# Altium project Quadrotor.PrjPcb
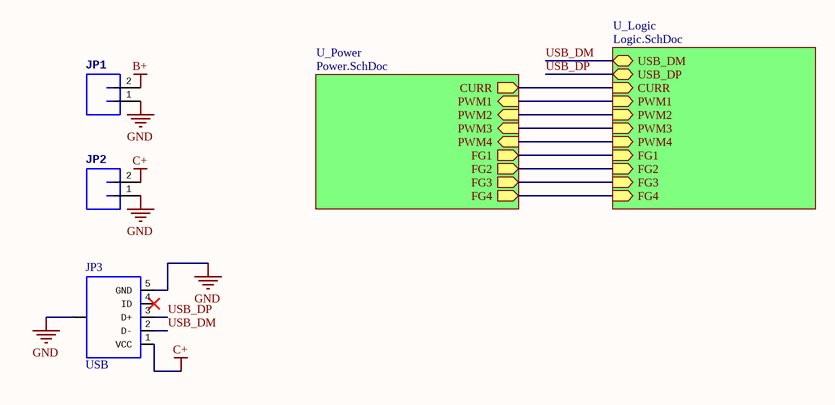
[diagram p0: Quadrotor.SchDoc]
3 sheets, 82 parts. Net scope: hierarchical (ports join the sheet entries above them; power ports are global).
Board file: Quadrotor.PcbDoc
Sheets:
  Quadrotor.SchDoc
    U_Logic = Logic.SchDoc
    U_Power = Power.SchDoc

## Sheet Quadrotor.SchDoc
size A

### Parts
JP1  (no value)  [JST-2-PTH-VERT]
JP2  (no value)  [JST-2-PTH-VERT]
JP3  USB  [USB-MICROB]

### Sub-sheets
U_Logic = Logic.SchDoc: USB_DM (bidir), USB_DP (bidir), CURR (in), PWM1 (in), PWM2 (in), PWM3 (in), PWM4 (in), FG1 (in), FG2 (in), FG3 (in), FG4 (in)
U_Power = Power.SchDoc: PWM1 (in), PWM2 (in), PWM3 (in), PWM4 (in), FG1 (out), FG2 (out), FG3 (out), FG4 (out), CURR (out)

### Nets
B+: JP1.2
C+: JP2.2 JP3.1(VCC)
GND: JP1.1 JP2.1 JP3.5(GND) JP3.6(SHIELD)
USB_DM: JP3.2(D-) ; sheet U_Logic/USB_DM
USB_DP: JP3.3(D+) ; sheet U_Logic/USB_DP
NetR3_1: sheet U_Logic/FG4, sheet U_Power/FG4
NetR4_1: sheet U_Logic/FG3, sheet U_Power/FG3
NetR6_2: sheet U_Logic/FG1, sheet U_Power/FG1
NetR7_2: sheet U_Logic/FG2, sheet U_Power/FG2
NetU1_14: sheet U_Logic/PWM1, sheet U_Power/PWM1
NetU1_15: sheet U_Logic/PWM2, sheet U_Power/PWM2
NetU1_16: sheet U_Logic/PWM3, sheet U_Power/PWM3
NetU1_17: sheet U_Logic/PWM4, sheet U_Power/PWM4
NetU1_26: sheet U_Logic/CURR, sheet U_Power/CURR

Not connected (* = marked no-connect by the designer): JP3 4(ID)*

### Library data of the parts
JP1 JP2 = JST_2_RIGHT
JP3 = USB_MICROB_PLUG-SMT: pin to pad: 1>VBUS 2>D- 3>D+ 4>ID 5>GND 6>MT1+P$1+P$2+MT2; PROD_ID: CONN-09900

## Sheet Logic.SchDoc
size A
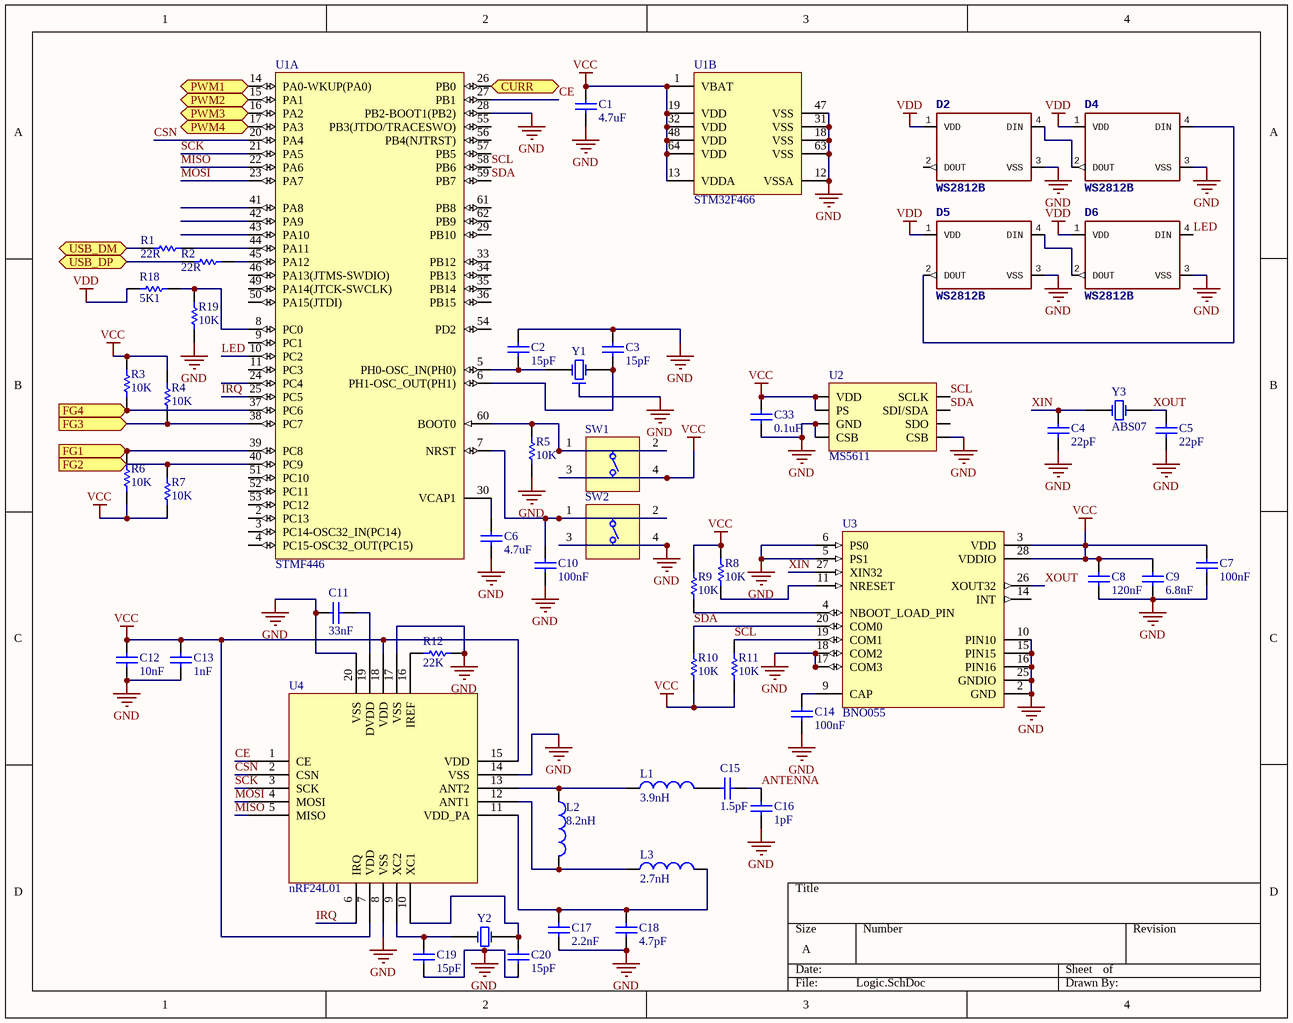
[diagram p1: Logic.SchDoc]

### Parts
C1  4.7uF  [CAPC0402(1005)60_L]
C2  15pF  [CAPC0402(1005)60_M]
C3  15pF  [CAPC0402(1005)60_M]
C4  22pF  [CAPC0402(1005)60_L]
C5  22pF  [CAPC0402(1005)60_L]
C6  4.7uF  [CAPC0402(1005)60_L]
C7  100nF  [CAPC0402(1005)60_M]
C8  120nF  [CAPC0402(1005)60_M]
C9  6.8nF  [CAPC0402(1005)60_L]
C10  100nF  [CAPC0402(1005)60_M]
C11  33nF  [CAPC0402(1005)60_M]
C12  10nF  [CAPC0402(1005)60_M]
C13  1nF  [CAPC0402(1005)60_M]
C14  100nF  [CAPC0402(1005)60_M]
C15  1.5pF  [CAPC0402(1005)60_L]
C16  1pF  [CAPC0402(1005)60_M]
C17  2.2nF  [CAPC0402(1005)60_N]
C18  4.7pF  [CAPC0402(1005)60_M]
C19  15pF  [CAPC0402(1005)60_N]
C20  15pF  [CAPC0402(1005)60_N]
C33  0.1uF  [CAPC0402(1005)60_M]
D2  WS2812B  [WS2812B]
D4  WS2812B  [WS2812B]
D5  WS2812B  [WS2812B]
D6  WS2812B  [WS2812B]
L1  3.9nH  [INDC0402(1005)_N]
L2  8.2nH  [INDC0402(1005)_N]
L3  2.7nH  [INDC0402(1005)_N]
R1  22R  [RESC0402(1005)_M]
R2  22R  [RESC0402(1005)_M]
R3  10K  [RESC0402(1005)_N]
R4  10K  [RESC0402(1005)_N]
R5  10K  [RESC0402(1005)_N]
R6  10K  [RESC0402(1005)_N]
R7  10K  [RESC0402(1005)_N]
R8  10K  [RESC0402(1005)_N]
R9  10K  [RESC0402(1005)_N]
R10  10K  [RESC0402(1005)_N]
R11  10K  [RESC0402(1005)_N]
R12  22K  [RESC0402(1005)_L]
R18  5K1  [RESC0402(1005)_L]
R19  10K  [RESC0402(1005)_N]
SW1  (no value)  [SWITCH]
SW2  (no value)  [SWITCH]
U1  STMF446  [STM-LQFP64_N]  (parts A,B of 2)
U2  MS5611  [MS5611]
U3  BNO055  [LGA28R50P4X10_380X520X100]
U4  (no value)  [QFN20]
Y1  (no value)  [ABRA-ABM3B-4_V]
Y2  (no value)  [ABRA-ABM3B-4_V]
Y3  ABS07  [ABS07]

### Ports
CURR (in), FG1 (in), FG2 (in), FG3 (in), FG4 (in), PWM1 (in), PWM2 (in), PWM3 (in), PWM4 (in), USB_DM (bidir), USB_DP (bidir)

### Nets
GND: C1.1 C2.2 C3.2 C4.1 C5.1 C6.1 C7.1 C8.1 C9.1 C10.1 C11.1 C12.1 C13.1 C14.1 C16.1 C17.1 C18.1 C19.1 C20.1 C33.1 D2.3(VSS) D4.3(VSS) D5.3(VSS) D6.3(VSS) R5.1 R12.1 R19.1 SW2.3(T3) SW2.4(T3) U1.12(VSSA) U1.18(VSS) U1.28(PB2-BOOT1(PB2)) U1.31(VSS) U1.47(VSS) U1.63(VSS) U2.3(GND) U2.4(CSB) U2.5(CSB) U3.2(GND) U3.5(PS1) U3.6(PS0) U3.10(PIN10) U3.15(PIN15) U3.16(PIN16) U3.17(COM3) U3.18(COM2) U3.25(GNDIO) U4.8(VSS) U4.14(VSS) U4.17(VSS) U4.20(VSS) Y1.2 Y2.2
VCC: C1.2 C7.2 C8.2 C9.2 C12.2 C13.2 C33.2 R3.2 R4.2 R6.1 R7.1 R8.2 R9.2 R10.1 R11.1 SW1.3(T3) SW1.4(T3) U1.1(VBAT) U1.13(VDDA) U1.19(VDD) U1.32(VDD) U1.48(VDD) U1.64(VDD) U2.1(VDD) U2.2(PS) U3.3(VDD) U3.28(VDDIO) U4.7(VDD) U4.15(VDD) U4.18(VDD)
VDD: D2.1(VDD) D4.1(VDD) D5.1(VDD) D6.1(VDD) R18.2
ANTENNA: C15.2 C16.2
CE: U1.27(PB1) U4.1(CE)
CSN: U1.20(PA4) U4.2(CSN)
IRQ: U1.25(PC5) U4.6(IRQ)
LED: D6.4(DIN) U1.10(PC2)
MISO: U1.22(PA6) U4.5(MISO)
MOSI: U1.23(PA7) U4.4(MOSI)
SCK: U1.21(PA5) U4.3(SCK)
SCL: R11.2 U1.58(PB6) U2.8(SCLK) U3.19(COM1)
SDA: R10.2 U1.59(PB7) U2.7(SDI/SDA) U3.20(COM0)
USB_DM: R1.1 ; port USB_DM
USB_DP: R2.1 ; port USB_DP
XIN: C4.2 U3.27(XIN32) Y3.1(X1)
XOUT: C5.2 U3.26(XOUT32) Y3.2(X2)
NetC2_1: C2.1 U1.5(PH0-OSC_IN(PH0)) Y1.1(X1)
NetC3_1: C3.1 U1.6(PH1-OSC_OUT(PH1)) Y1.3(X2)
NetC6_2: C6.2 U1.30(VCAP1)
NetC10_2: C10.2 SW2.1(T1) SW2.2(T2) U1.7(NRST)
NetC11_2: C11.2 U4.19(DVDD)
NetC14_2: C14.2 U3.9(CAP)
NetC15_1: C15.1 L1.2
NetC17_2: C17.2 C18.2 L3.2 U4.11(VDD_PA)
NetC19_2: C19.2 U4.9(XC2) Y2.1(X1)
NetC20_2: C20.2 U4.10(XC1) Y2.3(X2)
NetD2_4: D2.4(DIN) D4.2(DOUT)
NetD4_4: D4.4(DIN) D5.2(DOUT)
NetD5_4: D5.4(DIN) D6.2(DOUT)
NetL1_1: L1.1 L2.1 U4.13(ANT2)
NetL2_2: L2.2 L3.1 U4.12(ANT1)
NetR1_2: R1.2 U1.44(PA11)
NetR2_2: R2.2 U1.45(PA12)
NetR3_1: R3.1 U1.37(PC6) ; port FG4
NetR4_1: R4.1 U1.38(PC7) ; port FG3
NetR5_2: R5.2 SW1.1(T1) SW1.2(T2) U1.60(BOOT0)
NetR6_2: R6.2 U1.39(PC8) ; port FG1
NetR7_2: R7.2 U1.40(PC9) ; port FG2
NetR8_1: R8.1 U3.11(NRESET)
NetR9_1: R9.1 U3.4(NBOOT_LOAD_PIN)
NetR12_2: R12.2 U4.16(IREF)
NetR18_1: R18.1 R19.2 U1.8(PC0)
NetU1_14: U1.14(PA0-WKUP(PA0)) ; port PWM1
NetU1_15: U1.15(PA1) ; port PWM2
NetU1_16: U1.16(PA2) ; port PWM3
NetU1_17: U1.17(PA3) ; port PWM4
NetU1_26: U1.26(PB0) ; port CURR

Not connected (* = marked no-connect by the designer): D2 2(DOUT); U1 2(PC13) 3(PC14-OSC32_IN(PC14)) 4(PC15-OSC32_OUT(PC15)) 9(PC1) 11(PC3) 24(PC4) 29(PB10) 33(PB12) 34(PB13) 35(PB14) 36(PB15) 41(PA8) 42(PA9) 43(PA10) 46(PA13(JTMS-SWDIO)) 49(PA14(JTCK-SWCLK)) 50(PA15(JTDI)) 51(PC10) 52(PC11) 53(PC12) 54(PD2) 55(PB3(JTDO/TRACESWO)) 56(PB4(NJTRST)) 57(PB5) 61(PB8) 62(PB9); U2 6(SDO); U3 14(INT)

### Notes on the sheet
- (in symbol NRF24L01+) nRF24L01

### Library data of the parts
C1 C6 = CMP-1034-02136-1: CAP 4.7uF 6.3V ±10% 0402 (1005 Metric) Thickness 0.6mm SMD; Case-EIA: 0402; Tolerance: Â±10%; Case-Metric: 1005; Technology: SMT; Value: 4.7uF; Max Thickness: 0.6 mm; Rated Voltage: 6.3 V
C2 C3 = CMP-1034-00804-1: CAP 15pF 25V ±0.25pF 0402 (1005 Metric) Thickness 0.6mm SMD; Case-EIA: 0402; Tolerance: Â±0.25pF; Case-Metric: 1005; Rated Voltage: 25 V; Max Thickness: 0.6 mm; Value: 15pF; Technology: SMT
C4 C5 = CMP-1034-00911-1: CAP 22pF 25V ±10% 0402 (1005 Metric) Thickness 0.6mm SMD; Case-Metric: 1005; Case-EIA: 0402; Tolerance: Â±10%; Technology: SMT; Max Thickness: 0.6 mm; Rated Voltage: 25 V; Value: 22pF
C7 C8 C10 C14 C33 = CMP-1034-02060-1: CAP 100nF 6.3V ±5% 0402 (1005 Metric) Thickness 0.6mm SMD; Case-EIA: 0402; Tolerance: Â±5%; Case-Metric: 1005; Rated Voltage: 6.3 V; Max Thickness: 0.6 mm; Value: 100nF; Technology: SMT
C9 = CMP-1034-01836-1: CAP 6.8nF 6.3V ±5% 0402 (1005 Metric) Thickness 0.6mm SMD; Case-EIA: 0402; Tolerance: Â±5%; Case-Metric: 1005; Max Thickness: 0.6 mm; Rated Voltage: 6.3 V; Value: 6.8nF; Technology: SMT
C11 = CMP-1034-01977-1: CAP 33nF 6.3V ±10% 0402 (1005 Metric) Thickness 0.6mm SMD; Tolerance: Â±10%; Case-Metric: 1005; Case-EIA: 0402; Technology: SMT; Rated Voltage: 6.3 V; Max Thickness: 0.6 mm; Value: 33nF
C12 = CMP-1034-01867-1: CAP 10nF 6.3V ±5% 0402 (1005 Metric) Thickness 0.6mm SMD; Case-EIA: 0402; Case-Metric: 1005; Tolerance: Â±5%; Technology: SMT; Rated Voltage: 6.3 V; Max Thickness: 0.6 mm; Value: 10nF
C13 = CMP-1034-01609-1: CAP 1nF 6.3V ±5% 0402 (1005 Metric) Thickness 0.6mm SMD; Case-EIA: 0402; Tolerance: Â±5%; Case-Metric: 1005; Rated Voltage: 6.3 V; Value: 1nF; Technology: SMT; Max Thickness: 0.6 mm
C15 = CMP-1034-00110-1: CAP 1.5pF 25V ±0.5pF 0402 (1005 Metric) Thickness 0.6mm SMD; Case-EIA: 0402; Case-Metric: 1005; Tolerance: Â±0.5pF; Max Thickness: 0.6 mm; Technology: SMT; Value: 1.5pF; Rated Voltage: 25 V
C16 = CMP-1034-00055-1: CAP 1pF 25V ±0.5pF 0402 (1005 Metric) Thickness 0.6mm SMD; Case-Metric: 1005; Tolerance: Â±0.5pF; Case-EIA: 0402; Value: 1pF; Rated Voltage: 25 V; Technology: SMT; Max Thickness: 0.6 mm
C17 = CMP-1034-01722-1: CAP 2.2nF 6.3V ±5% 0402 (1005 Metric) Thickness 0.6mm SMD; Tolerance: Â±5%; Case-EIA: 0402; Case-Metric: 1005; Max Thickness: 0.6 mm; Technology: SMT; Rated Voltage: 6.3 V; Value: 2.2nF
C18 = CMP-1034-00362-1: CAP 4.7pF 25V ±0.1pF 0402 (1005 Metric) Thickness 0.6mm SMD; Case-EIA: 0402; Case-Metric: 1005; Tolerance: Â±0.1pF; Max Thickness: 0.6 mm; Value: 4.7pF; Technology: SMT; Rated Voltage: 25 V
C19 C20 = CMP-1034-00809-1: CAP 15pF 25V ±10% 0402 (1005 Metric) Thickness 0.6mm SMD; Tolerance: Â±10%; Case-Metric: 1005; Case-EIA: 0402; Rated Voltage: 25 V; Value: 15pF; Max Thickness: 0.6 mm; Technology: SMT
D2 D4-D6 = WS2812B: PROD_ID: DIO-12503
L1-L3 = INDC0402: Inductor; Code_IEC: 1005; Published: 8-Jun-2000; LatestRevisionDate: 29-May-2009; LatestRevisionNote: IPC-7351 Footprint Added.; PackageReference: 0402-A; Publisher: Altium Limited; PackageDescription: Chip Inductor; Code_JEITA: 0402
R1 R2 = CMP-1011-00034-1: 22R 0.063W 5% 0402 (1005 Metric)  SMD; Value: 22.00 Ohm; Case-EIA: 0402; Case-Metric: 1005; Power: 0.063 W; Tolerance: 5 %; Technology: SMT
R3-R11 R19 = CMP-1011-00098-1: 10K 0.063W 5% 0402 (1005 Metric)  SMD; Case-Metric: 1005; Value: 10000.00 Ohm; Case-EIA: 0402; Technology: SMT; Tolerance: 5 %; Power: 0.063 W
R12 = CMP-1011-00106-1: 22K 0.063W 5% 0402 (1005 Metric)  SMD; Case-Metric: 1005; Value: 22000.00 Ohm; Case-EIA: 0402; Tolerance: 5 %; Technology: SMT; Power: 0.063 W
R18 = CMP-1011-00091-1: 5K1 0.063W 5% 0402 (1005 Metric)  SMD; Case-EIA: 0402; Value: 5100.00 Ohm; Case-Metric: 1005; Technology: SMT; Tolerance: 5 %; Power: 0.063 W
SW1 SW2 = DIPT-DTSM-6: Switch, SPNO Push Button SMD; Manufacturer: Diptronics; PartNumber: DTSM-61NT/R; Packing Type: Tape&Reel; Mechanical Life: 200,000 cycles; ComponentLink2URL: http://www.dip.com.tw/Products_tact.htm; ComponentLink1URL: http://www.dip.com.tw/; ComponentLink3URL: http://www.dip.com.tw/PDF/pro_tact/DTSM_G_-6_2_-V.pdf; PackageDescription: Switch, Through-Hole, 4 Leads, Body 8.5x8.5mm, Row Spacing 9.0mm, Pitch 4.5mm; ComponentLink2Description: Datasheet; ComponentLink3Description: Package Specification; ComponentLink1Description: Manufacturer URL; PackageReference: DTSM-6; Mounting Technology: Through Hole
U1 = MC-ARM-STM32F4X5-SQ64
U4 = NRF24L01+: Part Field 1: 0603
Y1 Y2 = ABRA-ABM3B-4
U3 = BNO055: Value: *

## Sheet Power.SchDoc
size A
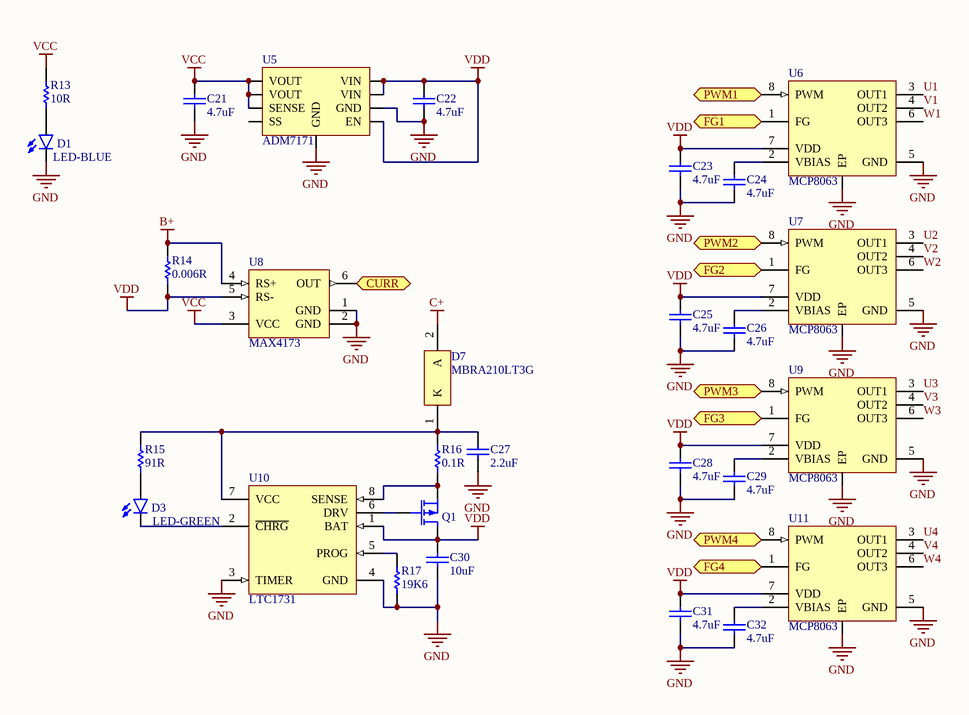
[diagram p2: Power.SchDoc]

### Parts
C21  4.7uF  [CAPC0402(1005)60_L]
C22  4.7uF  [CAPC0402(1005)60_L]
C23  4.7uF  [CAPC0402(1005)60_L]
C24  4.7uF  [CAPC0402(1005)60_L]
C25  4.7uF  [CAPC0402(1005)60_L]
C26  4.7uF  [CAPC0402(1005)60_L]
C27  2.2uF  [CAPC0402(1005)60_M]
C28  4.7uF  [CAPC0402(1005)60_L]
C29  4.7uF  [CAPC0402(1005)60_L]
C30  10uF  [CAPC0402(1005)60_N]
C31  4.7uF  [CAPC0402(1005)60_L]
C32  4.7uF  [CAPC0402(1005)60_L]
D1  LED-BLUE  [LED-1206]
D3  LED-GREEN  [LED-1206]
D7  MBRA210LT3G  [ONSC-SMA-2-403D-02_F_V]
Q1  MOSFET-P  [SOT23-3]  (value not drawn)
R13  10R  [RESC0402(1005)_N]
R14  0.006R  [RESC0805(2012)_N]
R15  91R  [RESC0402(1005)_M]
R16  0.1R  [RESC0603(1608)_M]
R17  19K6  [RESC0402(1005)_M]
U5  ADM7171  [SON50P300X85_HS-9N]
U6  MCP8063  [DFN8]
U7  MCP8063  [DFN8]
U8  MAX4173  [MAXM-U6+1_M]
U9  MCP8063  [DFN8]
U10  LTC1731  [LT-MS8-8_L]
U11  MCP8063  [DFN8]

### Ports
CURR (out), FG1 (out), FG2 (out), FG3 (out), FG4 (out), PWM1 (in), PWM2 (in), PWM3 (in), PWM4 (in)

### Nets
B+: R14.2 U8.4(RS+)
C+: D7.2(A)
GND: C21.1 C22.1 C23.1 C24.2 C25.1 C26.2 C27.1 C28.1 C29.2 C30.1 C31.1 C32.2 D1.C R17.1 U5.6(GND) U5.9(GND) U6.5(GND) U6.9(EP) U7.5(GND) U7.9(EP) U8.1(GND) U8.2(GND) U9.5(GND) U9.9(EP) U10.3(TIMER) U10.4(GND) U11.5(GND) U11.9(EP)
VCC: C21.2 R13.2 U5.1(VOUT) U5.2(VOUT) U5.3(SENSE) U8.3(VCC)
VDD: C22.2 C23.2 C25.2 C28.2 C30.2 C31.2 Q1.2(D) R14.1 U5.5(EN) U5.7(VIN) U5.8(VIN) U6.7(VDD) U7.7(VDD) U8.5(RS-) U9.7(VDD) U10.1(BAT) U11.7(VDD)
U1: U6.3(OUT1)
U2: U7.3(OUT1)
U3: U9.3(OUT1)
U4: U11.3(OUT1)
V1: U6.4(OUT2)
V2: U7.4(OUT2)
V3: U9.4(OUT2)
V4: U11.4(OUT2)
W1: U6.6(OUT3)
W2: U7.6(OUT3)
W3: U9.6(OUT3)
W4: U11.6(OUT3)
NetC24_1: C24.1 U6.2(VBIAS)
NetC26_1: C26.1 U7.2(VBIAS)
NetC27_2: C27.2 D7.1(K) R15.2 R16.2 U10.7(VCC)
NetC29_1: C29.1 U9.2(VBIAS)
NetC32_1: C32.1 U11.2(VBIAS)
NetD1_A: D1.A R13.1
NetD3_A: D3.A R15.1
NetD3_C: D3.C U10.2(~{CHRG})
NetQ1_1: Q1.1(G) U10.6(DRV)
NetQ1_3: Q1.3(S) R16.1 U10.8(SENSE)
NetR3_1: U11.1(FG) ; port FG4
NetR4_1: U9.1(FG) ; port FG3
NetR6_2: U6.1(FG) ; port FG1
NetR7_2: U7.1(FG) ; port FG2
NetR17_2: R17.2 U10.5(PROG)
NetU1_14: U6.8(PWM) ; port PWM1
NetU1_15: U7.8(PWM) ; port PWM2
NetU1_16: U9.8(PWM) ; port PWM3
NetU1_17: U11.8(PWM) ; port PWM4
NetU1_26: U8.6(OUT) ; port CURR

Not connected (* = marked no-connect by the designer): U5 4(SS)

### Library data of the parts
C21-C26 C28 C29 C31 C32 = CMP-1034-02136-1: as C1 on sheet Logic; Technology: SMT; Value: 4.7uF; Max Thickness: 0.6 mm; Rated Voltage: 6.3 V
C27 = CMP-1034-02125-1: CAP 2.2uF 6.3V ±10% 0402 (1005 Metric) Thickness 0.6mm SMD; Case-Metric: 1005; Case-EIA: 0402; Tolerance: Â±10%; Value: 2.2uF; Technology: SMT; Rated Voltage: 6.3 V; Max Thickness: 0.6 mm
C30 = CMP-1034-02138-1: CAP 10uF 6.3V ±20% 0402 (1005 Metric) Thickness 0.6mm SMD; Case-Metric: 1005; Case-EIA: 0402; Tolerance: Â±20%; Rated Voltage: 6.3 V; Technology: SMT; Max Thickness: 0.6 mm; Value: 10uF
D1 = LED-BLUE1206: PROD_ID: DIO-09911
D3 = LED-GREEN1206: PROD_ID: DIO-00862
D7 = CMP-1055-00309-1: Schottky Power Rectifier, 2-Pin SMA, Pb-Free, Tape and Reel; Manufacturer: On Semiconductor; IFSM Max (A): 160; Configuration: Single; ComponentLink3URL: http://www.onsemi.com/pub_link/Collateral/1SMA5913BT3-D.PDF; Packing: Tape and Reel; ComponentLink2Description: Datasheet; ComponentLink3Description: Package Specification; PackageVersion: Rev. F, 11/2008; DatasheetVersion: Rev. 5; RoHS: TRUE; PackageReference: SMA-2-403D-02_F; ComponentLink1URL: http://www.onsemi.com/; ComponentLink2URL: http://www.onsemi.cn/pub_link/Collateral/MBRA210LT3-D.PDF; ComponentLink1Description: Manufacturer URL; PartNumber: MBRA210LT3G; Mounting Technology: Surface Mount; PackageDescription: 2-Pin Small Molded Package, J-Bend Lead, Body 2.605 x 4.315 mm
Q1 = MOSFET-P: P-Channel MOSFET; Published: 8-Jun-2000; LatestRevisionDate: 17-Jul-2002; LatestRevisionNote: Re-released for DXP Platform.; PackageVersion: 1995/1996; PackageReference: E3; Publisher: Altium Limited; PackageDescription: TO, Flat Index; 3 In-Line, Axial Leads; Body Dia. 4.6mm; Lead Dia. 0.5 mm (max)
R13 = CMP-1011-00026-1: 10R 0.063W 5% 0402 (1005 Metric)  SMD; Case-EIA: 0402; Case-Metric: 1005; Value: 10.00 Ohm; Power: 0.063 W; Tolerance: 5 %; Technology: SMT
R14 = CMP-1013-00001-1: Jumper 0805 (2012 Metric); Case-EIA: 0805; Value: 0.00 Ohm; Tolerance: None; Case-Metric: 2012; Technology: SMT; Power: None
R15 = CMP-1011-00049-1: 91R 0.063W 5% 0402 (1005 Metric)  SMD; Case-EIA: 0402; Value: 91.00 Ohm; Case-Metric: 1005; Technology: SMT; Power: 0.063 W; Tolerance: 5 %
R16 = CMP-1012-00002-1: 1R 0.1W 5% 0603 (1608 Metric)  SMD; Value: 1.00 Ohm; Case-Metric: 1608; Case-EIA: 0603; Power: 0.1 W; Technology: SMT; Tolerance: 5 %
R17 = CMP-1011-00105-1: 20K 0.063W 5% 0402 (1005 Metric)  SMD; Case-EIA: 0402; Value: 20000.00 Ohm; Case-Metric: 1005; Tolerance: 5 %; Power: 0.063 W; Technology: SMT
U6 U7 U9 U11 = MCP8063: 3-Phase Brushless DC Sinusoidal Sensorless Fan Motor Driver, MOSFET Output, 2 to 14 V, 8-pin SOP (SE8), Tube; PartNumber: MTD6501G-HC1; Manufacturer: Microchip; DatasheetVersion: Rev. B; ComponentLink1Description: Manufacturer URL; PackageDescription: 8-Lead Thermally Enhanced Plastic Small Outline, 4.9 x 3.9 mm Body, 1.27 mm Pitch; ComponentLink1URL: http://www.microchip.com; ComponentLink4URL: http://www.microchip.com/MTD6501G; ComponentLink3URL: http://www.microchip.com/stellent/groups/techpub_sg/documents/packagingspec/en012702.pdf; PackageVersion: C04-121A; ComponentLink2URL: http://ww1.microchip.com/downloads/en/DeviceDoc/22263B.pdf; ComponentLink2Description: Datasheet; ComponentLink3Description: Package Specification; PackageReference: SOP-SE8; Mounting Technology: Surface Mount; ComponentLink4Description: Product URL
U8 = CMP-0252-00331-1: Voltage-Output, High-Side Current-Sense Amplifier, 50 V / V Gain, -40 to 85 degC, 6-Pin SOT23 (U6+1), Pb-Free, Tape and Reel; PartNumber: MAX4173FEUT+T; Gain: 20 V/V, 50 V/V ,100 V/V; Bi-Dir. Curr. Sense: No; ComponentLink2URL: http://datasheets.maximintegrated.com/en/ds/MAX4173-MAX4173T.pdf; ComponentLink3URL: http://pdfserv.maximintegrated.com/package_dwgs/21-0058.PDF; ComponentLink3Description: Package Specification; DatasheetVersion: Rev. 5; PackageDescription: 6-Pin Small-Outline Transistor Package (U6+1), Body 2.9 x 1.625 mm, Pitch 0.95 mm; PackageReference: U6+1; Code_JEDEC: MO178; ComponentLink1Description: Manufacturer URL; Mounting Technology: Surface Mount; PackageVersion: Rev. N, 08/2012; ComponentLink1URL: http://www.maximintegrated.com/; ComponentLink2Description: Datasheet
U10 = CMP-0471-00369-1: Linear Charger with AC Adapter Detection, 4.5 to 12 V Vin, 8-pin SOP (MS8-8), -40 to 85 degC, Pb-Free, Tape and Reel; PartNumber: LTC1731EMS8-4.2#TRPBF; Manufacturer: Linear Technology; Float Voltage: 4.2 V; Battery Chemistry: Li-Ion, Li-Polymer; Vin Min(V): 4.5; Number of Cells: 1; Vin Max(V): 12; Charge Termination: On-board timer; ComponentLink3Description: Package Specification; ComponentLink2Description: Datasheet; Packing: Tape and Reel; PackageDescription: 8-Pin Plastic MSOP, Body 3 x 3 mm, Pitch 0.65 mm; ComponentLink3URL: http://cds.linear.com/docs/en/packaging/05081660_G_MS8.pdf; ComponentLink1URL: http://www.linear.com/; RoHS: TRUE; PackageReference: MS8-8; Mounting Technology: Surface Mount; Type of Charger: Linear; PackageVersion: Rev. G, 03/2012; ComponentLink2URL: http://cds.linear.com/docs/en/datasheet/1731f.pdf; ComponentLink1Description: Manufacturer URL

## Nets that join several sheets
B+: Quadrotor (JP1.2), Power (R14.2 U8.4)
C+: Quadrotor (JP2.2 JP3.1), Power (D7.2)
GND: Quadrotor (JP1.1 JP2.1 JP3.5 JP3.6), Logic (53 pins), Power (28 pins)
VCC: Logic (30 pins), Power (6 pins)
VDD: Logic (5 pins), Power (17 pins)
NetR3_1: Logic (R3.1 U1.37), Power (U11.1)
NetR4_1: Logic (R4.1 U1.38), Power (U9.1)
NetR6_2: Logic (R6.2 U1.39), Power (U6.1)
NetR7_2: Logic (R7.2 U1.40), Power (U7.1)
NetU1_14: Logic (U1.14), Power (U6.8)
NetU1_15: Logic (U1.15), Power (U7.8)
NetU1_16: Logic (U1.16), Power (U9.8)
NetU1_17: Logic (U1.17), Power (U11.8)
NetU1_26: Logic (U1.26), Power (U8.6)
USB_DM: Quadrotor (JP3.2), Logic (R1.1)
USB_DP: Quadrotor (JP3.3), Logic (R2.1)